# Altium schematic sheet MCU.SchDoc
size B; SheetNumber: 1; SheetTotal: 1
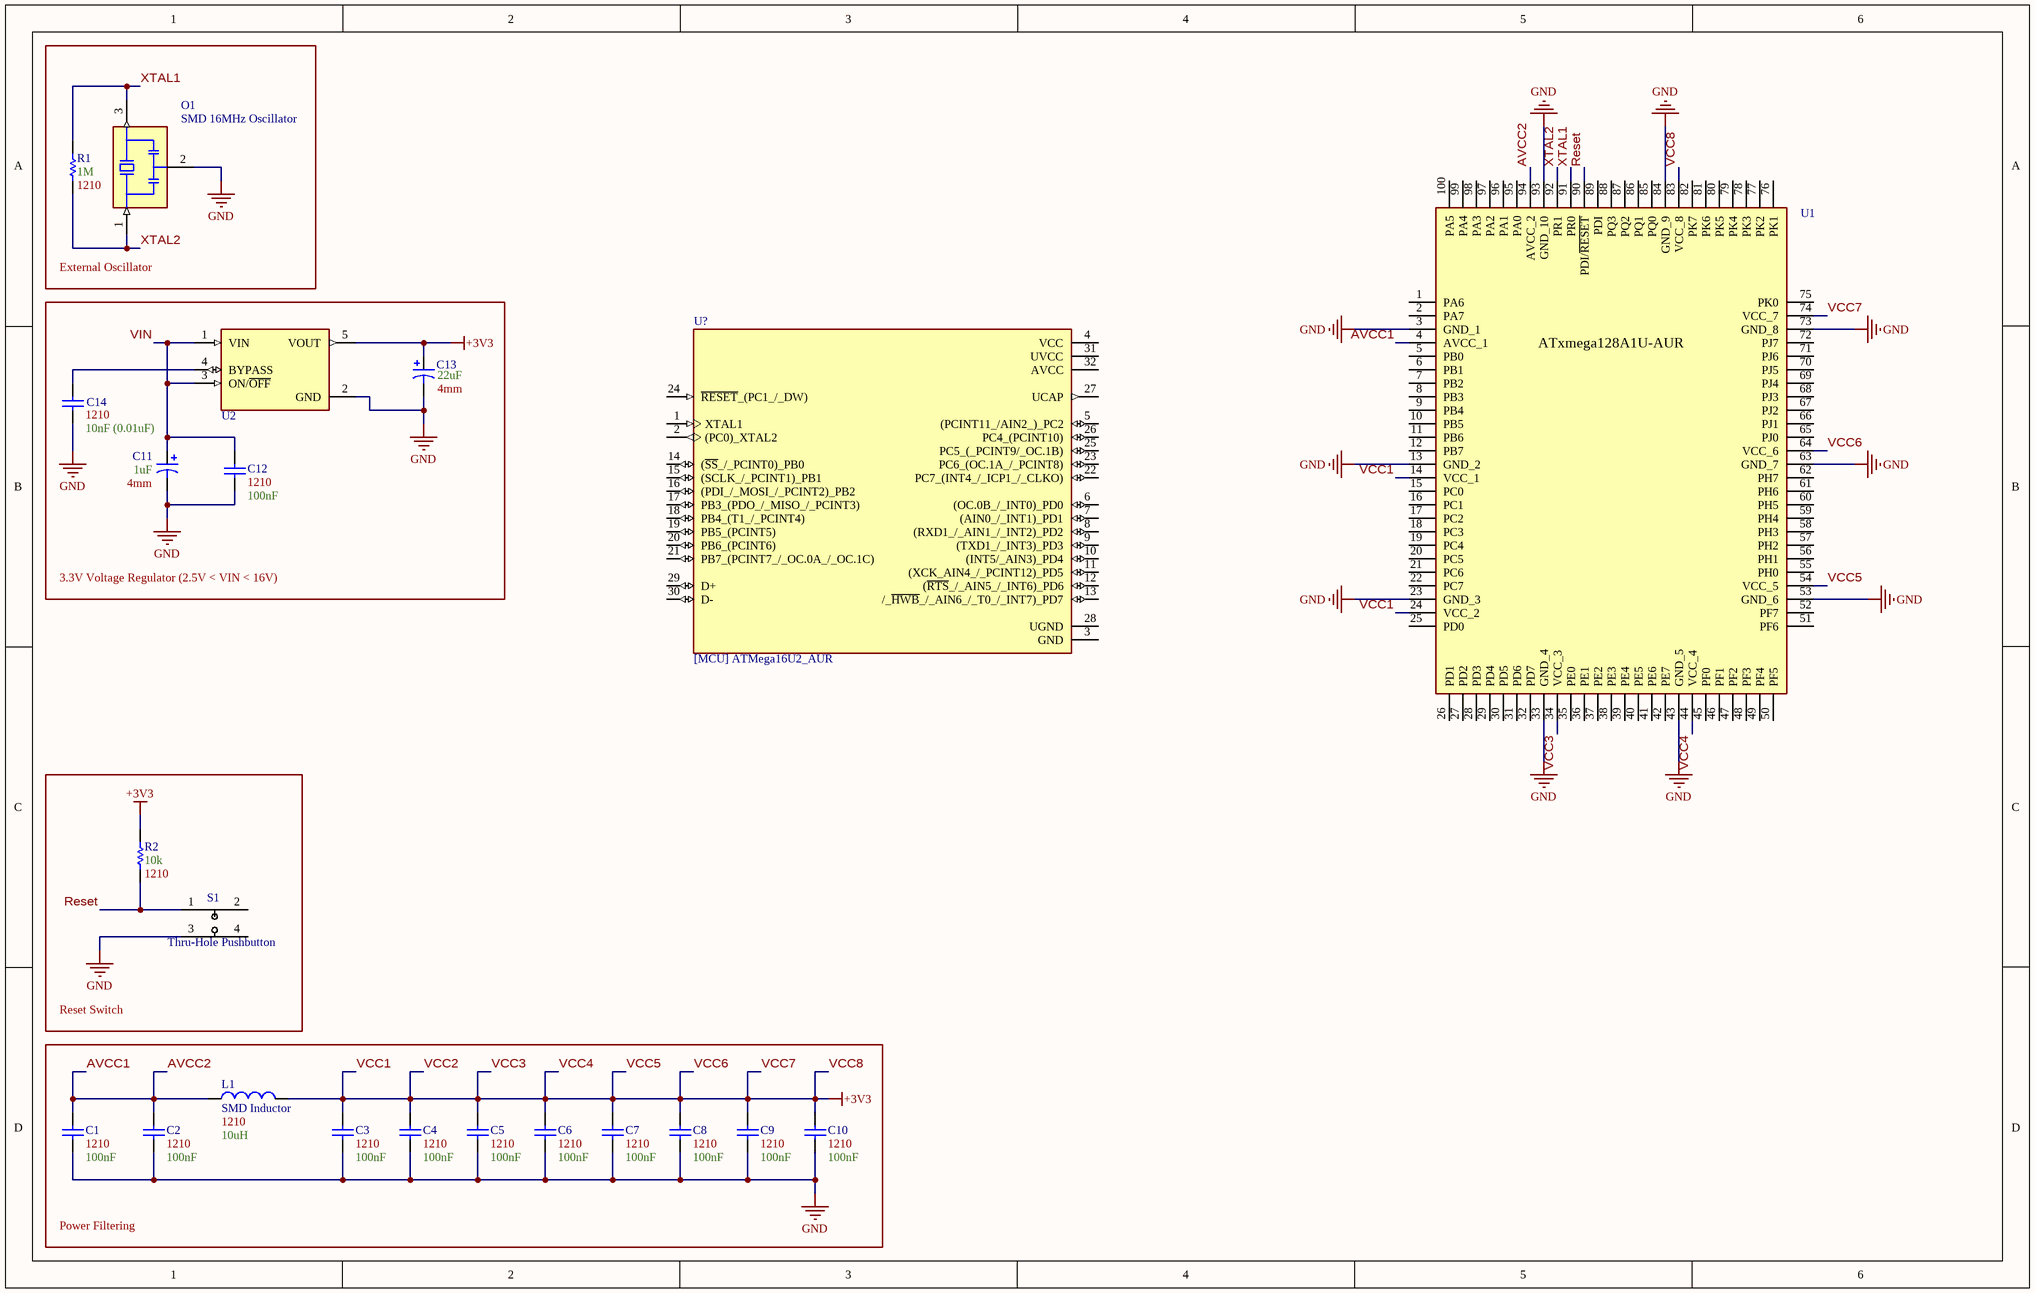
[diagram p0: MCU.SchDoc]

## Parts
C1  Size Package: 1210  Capacitance: 100nF  [SMD Capacitor [1210]]  (hidden comment: SMD Capacitor)
C2  Size Package: 1210  Capacitance: 100nF  [SMD Capacitor [1210]]  (hidden comment: SMD Capacitor)
C3  Size Package: 1210  Capacitance: 100nF  [SMD Capacitor [1210]]  (hidden comment: SMD Capacitor)
C4  Size Package: 1210  Capacitance: 100nF  [SMD Capacitor [1210]]  (hidden comment: SMD Capacitor)
C5  Size Package: 1210  Capacitance: 100nF  [SMD Capacitor [1210]]  (hidden comment: SMD Capacitor)
C6  Size Package: 1210  Capacitance: 100nF  [SMD Capacitor [1210]]  (hidden comment: SMD Capacitor)
C7  Size Package: 1210  Capacitance: 100nF  [SMD Capacitor [1210]]  (hidden comment: SMD Capacitor)
C8  Size Package: 1210  Capacitance: 100nF  [SMD Capacitor [1210]]  (hidden comment: SMD Capacitor)
C9  Size Package: 1210  Capacitance: 100nF  [SMD Capacitor [1210]]  (hidden comment: SMD Capacitor)
C10  Size Package: 1210  Capacitance: 100nF  [SMD Capacitor [1210]]  (hidden comment: SMD Capacitor)
C11  Capacitance: 1uF  Diameter: 4mm  [SMD Cap - Polarized]  (hidden comment: SMD Cap - Polarized)
C12  Size Package: 1210  Capacitance: 100nF  [SMD Capacitor [1210]]  (hidden comment: SMD Capacitor)
C13  Capacitance: 22uF  Diameter: 4mm  [SMD Cap - Polarized]  (hidden comment: SMD Cap - Polarized)
C14  Size Package: 1210  Capacitance: 10nF (0.01uF)  [SMD Capacitor [1210]]  (hidden comment: SMD Capacitor)
L1  SMD Inductor  Size Package: 1210  Inductance: 10uH  [SMD Inductor [0603]]
O1  SMD 16MHz Oscillator  [SMD 16MHz Oscillator [1]]
R1  Resistance: 1M  Size Package: 1210  [SMD Resistor [1210]]  (hidden comment: SMD Resistor)
R2  Resistance: 10k  Size Package: 1210  [SMD Resistor [1210]]  (hidden comment: SMD Resistor)
S1  Thru-Hole Pushbutton  [Thru-Hole Pushbutton]
U1  MCU - ATxmega128A1U-AUR  [MCU - Atxmega128A1U-AUR]  (value not drawn)
U2  SMD 3V3 Regulator  [SMD 3V3 Regulator]  (value not drawn)
U?  [MCU] ATMega16U2_AUR  [SMD ATMega16U2_AUR]

## Blocks framed on the sheet
External Oscillator: O1 R1
3.3V Voltage Regulator (2.5V < VIN < 16V): C11-C14 U2
Reset Switch: R2 S1
Power Filtering: C1-C10 L1

## Nets
GND: C1.1 C2.1 C3.1 C4.1 C5.1 C6.1 C7.1 C8.1 C9.1 C10.1 C11.2 C12.1 C13.2 C14.1 O1.2(GND) S1.3 U1.3(GND_1) U1.13(GND_2) U1.23(GND_3) U1.33(GND_4) U1.43(GND_5) U1.53(GND_6) U1.63(GND_7) U1.73(GND_8) U1.84(GND_9) U1.93(GND_10) U2.2(GND)
VCC1: C3.2 C4.2 C5.2 C6.2 C7.2 C8.2 C9.2 C10.2 C13.1 L1.2 R2.2 U1.14(VCC_1) U1.24(VCC_2) U1.34(VCC_3) U1.44(VCC_4) U1.54(VCC_5) U1.64(VCC_6) U1.74(VCC_7) U1.83(VCC_8) U2.5(VOUT)  [also labelled +3V3, VCC2, VCC3, VCC4, VCC5, VCC6, VCC7, VCC8]
AVCC1: C1.2 C2.2 L1.1 U1.4(AVCC_1) U1.94(AVCC_2)  [also labelled AVCC2]
Reset: R2.1 S1.1 U1.90(PDI/~{RESET})
VIN: C11.1 C12.2 U2.1(VIN) U2.3(ON/~{OFF})
XTAL1: O1.3(OUT) R1.2 U1.91(PR0)
XTAL2: O1.1(IN) R1.1 U1.92(PR1)
NetC14_2: C14.2 U2.4(BYPASS)

Not connected (* = marked no-connect by the designer): S1 2 4; U1 1(PA6) 2(PA7) 5(PB0) 6(PB1) 7(PB2) 8(PB3) 9(PB4) 10(PB5) 11(PB6) 12(PB7) 15(PC0) 16(PC1) 17(PC2) 18(PC3) 19(PC4) 20(PC5) 21(PC6) 22(PC7) 25(PD0) 26(PD1) 27(PD2) 28(PD3) 29(PD4) 30(PD5) 31(PD6) 32(PD7) 35(PE0) 36(PE1) 37(PE2) 38(PE3) 39(PE4) 40(PE5) 41(PE6) 42(PE7) 45(PF0) 46(PF1) 47(PF2) 48(PF3) 49(PF4) 50(PF5) 51(PF6) 52(PF7) 55(PH0) 56(PH1) 57(PH2) 58(PH3) 59(PH4) 60(PH5) 61(PH6) 62(PH7) 65(PJ0) 66(PJ1) 67(PJ2) 68(PJ3) 69(PJ4) 70(PJ5) 71(PJ6) 72(PJ7) 75(PK0) 76(PK1) 77(PK2) 78(PK3) 79(PK4) 80(PK5) 81(PK6) 82(PK7) 85(PQ0) 86(PQ1) 87(PQ2) 88(PQ3) 89(PDI) 95(PA0) 96(PA1) 97(PA2) 98(PA3) 99(PA4) 100(PA5); U? 1(XTAL1) 2((PC0)_XTAL2) 3(GND) 4(VCC) 5((PCINT11_/AIN2_)_PC2) 6((OC.0B_/_INT0)_PD0) 7((AIN0_/_INT1)_PD1) 8((RXD1_/_AIN1_/_INT2)_PD2) 9((TXD1_/_INT3)_PD3) 10((INT5/_AIN3)_PD4) 11((XCK_AIN4_/_PCINT12)_PD5) 12((~{RTS}_/_AIN5_/_INT6)_PD6) 13(/_~{HWB}_/_AIN6_/_T0_/_INT7)_PD7) 14((~{SS}_/_PCINT0)_PB0) 15((SCLK_/_PCINT1)_PB1) 16((PDI_/_MOSI_/_PCINT2)_PB2) 17(PB3_(PDO_/_MISO_/_PCINT3)) 18(PB4_(T1_/_PCINT4)) 19(PB5_(PCINT5)) 20(PB6_(PCINT6)) 21(PB7_(PCINT7_/_OC.0A_/_OC.1C)) 22(PC7_(INT4_/_ICP1_/_CLKO)) 23(PC6_(OC.1A_/_PCINT8)) 24(~{RESET}_(PC1_/_DW)) 25(PC5_(_PCINT9/_OC.1B)) 26(PC4_(PCINT10)) 27(UCAP) 28(UGND) 29(D+) 30(D-) 31(UVCC) 32(AVCC)

## Notes on the sheet
- (in symbol MCU - ATxmega128A1U-AUR) ATxmega128A1U-AUR

## Library data of the parts
O1 = SMD 16MHz Oscillator [1]: Part #: CSTNE16M0V530000R0 / JLC Part #: C341521; JLC Part #: C341521
R1 = SMD Resistor: JLC Part #: C728401 / (for 1M Ohm Res); JLC Part #: C728401; Mouser Part #: 71-CRCW12101M00FKEAH
S1 = Thru-Hole Pushbutton: Tactile 4pin SPST Pushbutton / (what I expect is a regular pushbutton)
U2 = SMD 3V3 Regulator: Part #: LP2985-33DBVR / JLC Part #: C95414; JLC Part #: C95414
U? = [MCU] ATMega16U2_AUR: JLC Part #: C507117
C1-C10 C12 C14 = SMD Capacitor: JLC Part #: *
  C1-C10: Mouser Part #: 581-12107C104KAT2A
  C12: Mouser Part #: *
  C14: Mouser Part #: 810-CGA6P1C0G3B103G2
C11 C13 = SMD Cap - Polarized: JLC Part #: *
  C11: Mouser Part #: 80-EXV105M050A9BAA
  C13: Mouser Part #: 80-EXV226M016A9BAA
L1 = SMD Inductor: JLC Part #: *; Mouser Part #: 963-LBC3225T100KR
R2 = SMD Resistor: Mouser Part #: 71-CRCW121010K0JNAIF
U1 = MCU - ATxmega128A1U-AUR: Mouser Part #: 556-ATXMEGA128A1UAUR; JLC Part #: C2053610; Package: TQFP-100(14x14)